# Altium schematic sheet JacdacRp2040BrainEc30 124 snapshot with PADAUK.SchDoc: complete design (part 1 of 2)
size A3; DocumentNumber: 1; SheetNumber: 1; SheetTotal: 1; VersionControl_RevNumber: 1
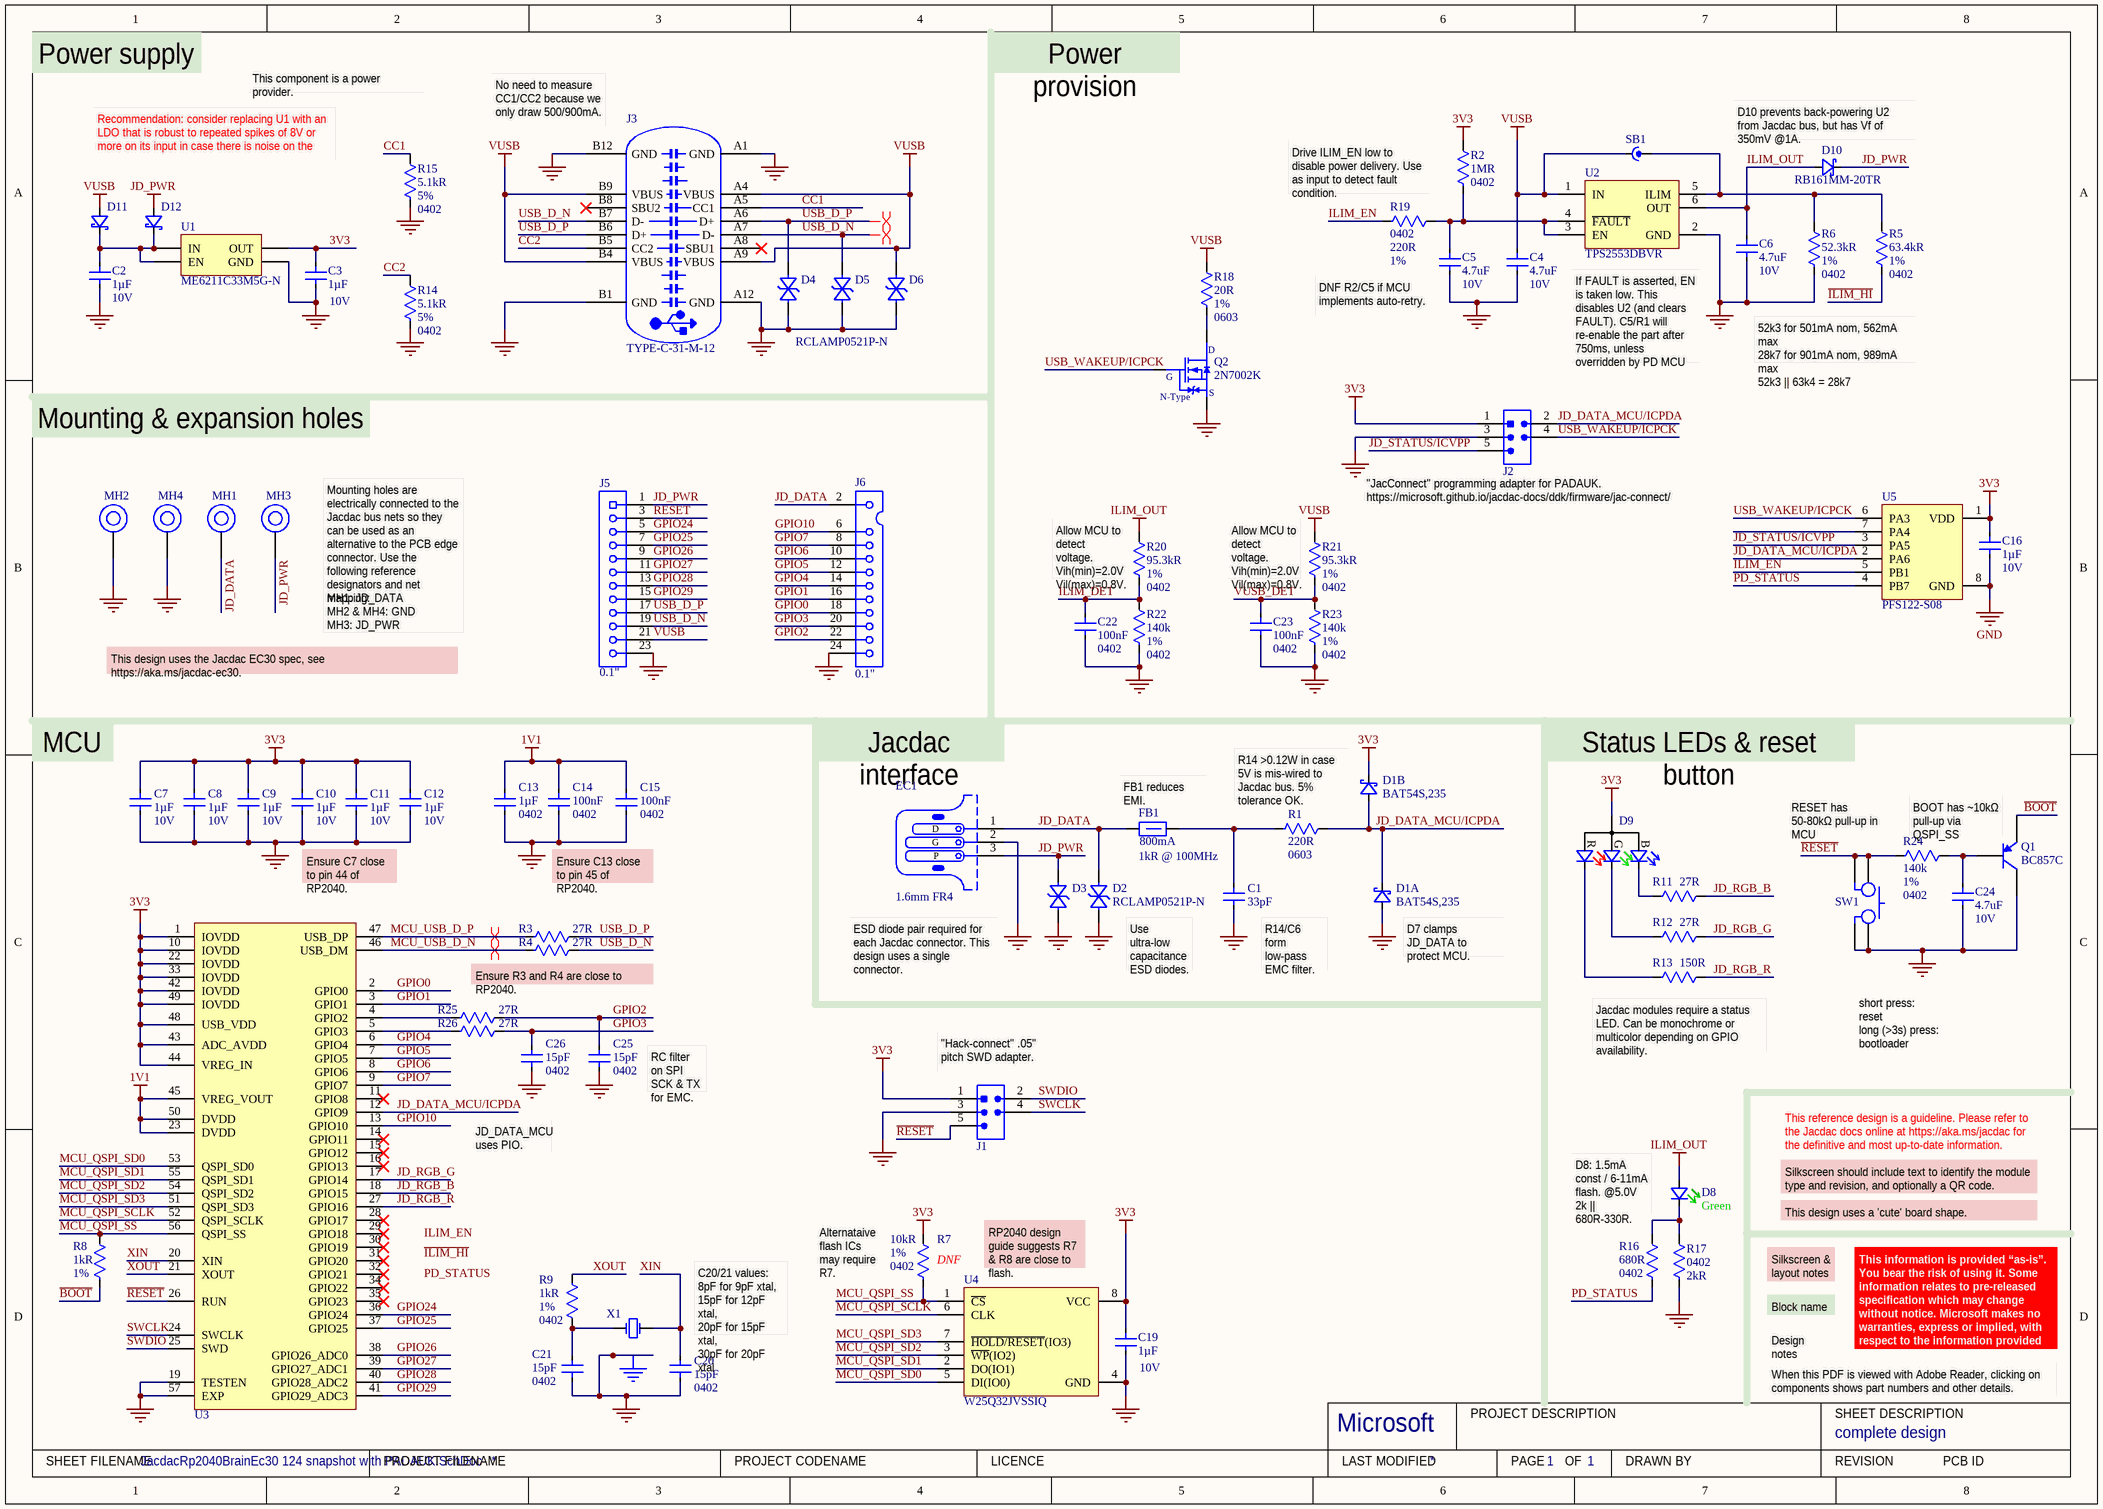
[diagram p0: JacdacRp2040BrainEc30 124 snapshot with PADAUK.SchDoc]

## Parts
C1  Capacitance: 33pF  [C0402_0.55MM - without outline]  (hidden comment: CL05C330JB51PNC)
C2  Capacitance: 1µF  Voltage Rating: 10V  [C0402_0.55MM - without outline]  (hidden comment: CL05A105KP5NNNC)
C3  Capacitance: 1µF  Voltage Rating: 10V  [C0402_0.55MM - without outline]  (hidden comment: CL05A105KP5NNNC)
C4  Capacitance: 4.7uF  Voltage Rating: 10V  [C0402_0.55mm - without outline]  (hidden comment: CL05A475MP5NRNC)
C5  Capacitance: 4.7uF  Voltage Rating: 10V  [C0402_0.55mm - without outline]  (hidden comment: CL05A475MP5NRNC)
C6  Capacitance: 4.7uF  Voltage Rating: 10V  [C0402_0.55mm - without outline]  (hidden comment: CL05A475MP5NRNC)
C7  Capacitance: 1µF  Voltage Rating: 10V  [C0402_0.55MM - without outline]  (hidden comment: CL05A105KP5NNNC)
C8  Capacitance: 1µF  Voltage Rating: 10V  [C0402_0.55MM - without outline]  (hidden comment: CL05A105KP5NNNC)
C9  Capacitance: 1µF  Voltage Rating: 10V  [C0402_0.55MM - without outline]  (hidden comment: CL05A105KP5NNNC)
C10  Capacitance: 1µF  Voltage Rating: 10V  [C0402_0.55MM - without outline]  (hidden comment: CL05A105KP5NNNC)
C11  Capacitance: 1µF  Voltage Rating: 10V  [C0402_0.55MM - without outline]  (hidden comment: CL05A105KP5NNNC)
C12  Capacitance: 1µF  Voltage Rating: 10V  [C0402_0.55MM - without outline]  (hidden comment: CL05A105KP5NNNC)
C13  Case/Package: 0402  Capacitance: 1µF  [C0402_0.55MM - without outline]  (hidden comment: CL05A105KP5NNNC)
C14  Capacitance: 100nF  Case Code (Imperial): 0402  [C0402_0.55MM - without outline]  (hidden comment: CL05B104KP5NNNC)
C15  Capacitance: 100nF  Case Code (Imperial): 0402  [C0402_0.55MM - without outline]  (hidden comment: CL05B104KP5NNNC)
C16  Capacitance: 1µF  Voltage Rating: 10V  [C0402_0.55MM - without outline]  (hidden comment: CL05A105KP5NNNC)
C19  Capacitance: 1µF  Voltage Rating: 10V  [C0402_0.55MM - without outline]  (hidden comment: CL05A105KP5NNNC)
C20  Capacitance: 15pF  Case/Package: 0402  [C0402_0.55MM - without outline]  (hidden comment: CL05C150JB5NNNC)
C21  Capacitance: 15pF  Case/Package: 0402  [C0402_0.55MM - without outline]  (hidden comment: CL05C150JB5NNNC)
C22  Capacitance: 100nF  Case Code (Imperial): 0402  [C0402_0.55MM - without outline]  (hidden comment: CL05B104KP5NNNC)
C23  Capacitance: 100nF  Case Code (Imperial): 0402  [C0402_0.55MM - without outline]  (hidden comment: CL05B104KP5NNNC)
C24  Capacitance: 4.7uF  Voltage Rating: 10V  [C0402_0.55mm - without outline]  (hidden comment: CL05A475MP5NRNC)
C25  Capacitance: 15pF  Case/Package: 0402  [C0402_0.55MM - without outline]  (hidden comment: CL05C150JB5NNNC)
C26  Capacitance: 15pF  Case/Package: 0402  [C0402_0.55MM - without outline]  (hidden comment: CL05C150JB5NNNC)
D1  Manufacturer Part Number: BAT54S,235  [NXP-BAT54S-TO-236AB - without outline]  (hidden comment: BAT54S)  (parts A,B of 2)
D2  RCLAMP0521P-N  [TVS 0402 - L]
D3  RCLAMP0521P-N  [TVS 0402 - L]  (value not drawn)
D4  RCLAMP0521P-N  [TVS 0402 - L]  (value not drawn)
D5  RCLAMP0521P-N  [TVS 0402 - L]  (value not drawn)
D6  RCLAMP0521P-N  [TVS 0402 - L]
D8  Colour: Green  [0603 Green]  (hidden comment: 19-217/GHC-YR1S2/3T)
D9  TZ-P4-1615RGBTCA1-0.55T  [TZ-P4-1615RGBTCA1-0.55T]  (value not drawn)
D10  RB161MM-20TR  [SOD-123F - without outline]
D11  RB161MM-20TR  [SOD-123F - without outline]  (value not drawn)
D12  RB161MM-20TR  [SOD-123F - without outline]  (value not drawn)
EC1  PCB Type: 1.6mm FR4  [JACDAC_EDGE_CONNECTOR_NO_TRACES]  (hidden comment: 3 pin JACDAC edge connector)  (no BOM)
FB1  Current Rating: 800mA  Impedance: 1kR @ 100MHz  [TDK MPZ1608 0.8mm - without outline]  (hidden comment: TDK MPZ1608S102ATA00)
J1  Hack Connect Mini 1.27 mm pitch 2-row  [HACK_CONNECT_MINI_5_X_1_27]  (value not drawn)  (no BOM)
J2  Hack Connect Mini 1.27 mm pitch 2-row  [HACK_CONNECT_MINI_5_X_1_27_0.559mm_TH]  (value not drawn)  (no BOM)
J3  TYPE-C-31-M-12  [TYPE-C-31-M-12]
J5  0.1"  [Jacdac EC30 stamp holes 30mm bottom]
J6  0.1"  [Jacdac EC30 stamp holes 30mm top]
MH1  MH_7.0MMK_4.4MMC_3.1MMD_PTH  [MH_7.0MMK_4.4MMC_3.1MMD_PTH]  (value not drawn)  (no BOM)
MH2  MH_7.0MMK_4.4MMC_3.1MMD_PTH  [MH_7.0MMK_4.4MMC_3.1MMD_PTH]  (value not drawn)  (no BOM)
MH3  MH_7.0MMK_4.4MMC_3.1MMD_PTH  [MH_7.0MMK_4.4MMC_3.1MMD_PTH]  (value not drawn)  (no BOM)
MH4  MH_7.0MMK_4.4MMC_3.1MMD_PTH  [MH_7.0MMK_4.4MMC_3.1MMD_PTH]  (value not drawn)  (no BOM)
Q1  BC857C  [NXP-SOT23 - without outline]
Q2  2N7002K  [SOT23-ONS]
R1  Case/Package: 0603  [RC0603]  (hidden comment: 220R)
R2  Resistance: 1MR  Case Code (Imperial): 0402  [R0402 - Without outline]
R3  Resistance: 27R  [R0402 - Without outline]  (hidden comment: RC0402FR-0727RL)
R4  Resistance: 27R  [R0402 - Without outline]  (hidden comment: RC0402FR-0727RL)
R5  Resistance: 63.4kR  Tolerance: 1%  Case Code (Imperial): 0402  [R0402 - Without outline]  (hidden comment: RC0402FR-0763K4L)
R6  Resistance: 52.3kR  Tolerance: 1%  Case Code (Imperial): 0402  [R0402 - Without outline]  (hidden comment: RC0402FR-0752K3L)
R7  Resistance: 10kR  Tolerance: 1%  Case Code (Imperial): 0402  [R0402 - Without outline]  (hidden comment: 10k)
R8  Resistance: 1kR  Tolerance: 1%  [R0402 - Without outline]  (hidden comment: RC0402FR-071KL)
R9  Resistance: 1kR  Tolerance: 1%  Case Code (Imperial): 0402  [R0402 - Without outline]  (hidden comment: RC0402FR-071KL)
R11  Resistance: 27R  [R0402 - Without outline]  (hidden comment: RC0402FR-0727RL)
R12  Resistance: 27R  [R0402 - Without outline]  (hidden comment: RC0402FR-0727RL)
R13  Resistance: 150R  [R0402 - Without outline]  (hidden comment: RC0402FR-07150RL)
R14  Resistance: 5.1kR  Tolerance: 5%  Case Code (Imperial): 0402  [R0402 - Without outline]  (hidden comment: RC0402JR-075K1L)
R15  Resistance: 5.1kR  Tolerance: 5%  Case Code (Imperial): 0402  [R0402 - Without outline]  (hidden comment: RC0402JR-075K1L)
R16  Resistance: 680R  Case Code (Imperial): 0402  [R0402 - Without outline]  (hidden comment: RC0402FR-07680RL)
R17  Case/Package: 0402  Resistance: 2kR  [R0402 - Without outline]  (hidden comment: RC0402FR-072KL)
R18  Resistance: 20R  Tolerance: 1%  Case Code (Imperial): 0603  [RC0603]  (hidden comment: RC0603FR-0720RL)
R19  Case Code (Imperial): 0402  Resistance: 220R  Tolerance: 1%  [R0402 - without outline]  (hidden comment: RC0402FR-07220RL)
R20  Resistance: 95.3kR  Tolerance: 1%  Case Code (Imperial): 0402  [R0402 - Without outline]  (hidden comment: RC0402FR-0795K3L)
R21  Resistance: 95.3kR  Tolerance: 1%  Case Code (Imperial): 0402  [R0402 - Without outline]  (hidden comment: RC0402FR-0795K3L)
R22  Resistance: 140k  Tolerance: 1%  Case/Package: 0402  [R0402 - Without outline]  (hidden comment: RC0402FR-07100KL)
R23  Resistance: 140k  Tolerance: 1%  Case/Package: 0402  [R0402 - Without outline]  (hidden comment: RC0402FR-07100KL)
R24  Resistance: 140k  Tolerance: 1%  Case/Package: 0402  [R0402 - Without outline]  (hidden comment: RC0402FR-07100KL)
R25  Resistance: 27R  [R0402 - Without outline]  (hidden comment: RC0402FR-0727RL)
R26  Resistance: 27R  [R0402 - Without outline]  (hidden comment: RC0402FR-0727RL)
SB1  OpenSolderBlob  [SolderBlobB]  (value not drawn)  (no BOM)
SW1  UK-B0267-SP25Y  [USAKRO-UK-B0267-SP25Y]  (value not drawn)
U1  ME6211C33M5G-N  [MICRONE-SOT23-5]
U2  TPS2553DBVR  [TI-TPS2553 - without_outline]
U3  RP2040  [RP2040-SAFER-VIAS]  (value not drawn)
U4  (no value)  [8-SOIC]
U5  PFS122-S08  [SOP-8]
X1  generic SMD xtal 3.2x2.5mm  [generic xtal 3.2x2.5]  (value not drawn)

## Nets
1V1: C13.2 C14.2 C15.2 U3.23(DVDD) U3.45(VREG_VOUT) U3.50(DVDD)
3V3: C3.2 C7.2 C8.2 C9.2 C10.2 C11.2 C12.2 C16.2 C19.2 D1.2(K) D9.1(A) J1.1(VCC) J2.1(VCC) R2.1 R7.1 U1.5(OUT) U3.1(IOVDD) U3.10(IOVDD) U3.22(IOVDD) U3.33(IOVDD) U3.42(IOVDD) U3.43(ADC_AVDD) U3.44(VREG_IN) U3.48(USB_VDD) U3.49(IOVDD) U4.8(VCC) U5.1(VDD)
GND: C1.1 C2.1 C3.1 C4.1 C5.1 C6.1 C7.1 C8.1 C9.1 C10.1 C11.1 C12.1 C13.1 C14.1 C15.1 C16.1 C19.1 C20.2 C21.2 C22.1 C23.1 C24.1 C25.2 C26.2 D1.1(A) D2.2(A) D3.2(A) D4.2(A) D5.2(A) D6.2(A) EC1.2(G) J1.3(GND) J2.3(GND) J3.A1(GND) J3.A12(GND) J3.B1(GND) J3.B12(GND) J5.23 J6.24 MH2.1 MH4.1 Q1.3(C) Q2.2(S) R6.1 R14.2 R15.2 R17.2 R22.1 R23.1 SW1.3 SW1.4 U1.2(GND) U2.2(GND) U3.19(TESTEN) U3.57(EXP) U4.4(GND) U5.8(GND) X1.2 X1.4
ILIM_OUT: C6.2 D8.2(A) D10.2(A) R20.2 U2.6(OUT)
JD_PWR: D3.1(K) D10.1(K) D12.2(A) EC1.3(P) J5.1 MH3.1
VUSB: C4.2 D6.1(K) D11.2(A) J3.A4(VBUS) J3.A9(VBUS) J3.B4(VBUS) J3.B9(VBUS) J5.21 R18.2 R21.2 SB1.2 U2.1(IN)
~{BOOT}: Q1.2(E) R8.2
CC1: J3.A5(CC1) R15.1
CC2: J3.B5(CC2) R14.1
GPIO0: J6.18 U3.2(GPIO0)
GPIO1: J6.16 U3.3(GPIO1)
GPIO2: C25.1 J6.22 R25.2
GPIO3: C26.1 J6.20 R26.2
GPIO4: J6.14 U3.6(GPIO4)
GPIO5: J6.12 U3.7(GPIO5)
GPIO6: J6.10 U3.8(GPIO6)
GPIO7: J6.8 U3.9(GPIO7)
GPIO10: J6.6 U3.13(GPIO10)
GPIO24: J5.5 U3.36(GPIO24)
GPIO25: J5.7 U3.37(GPIO25)
GPIO26: J5.9 U3.38(GPIO26_ADC0)
GPIO27: J5.11 U3.39(GPIO27_ADC1)
GPIO28: J5.13 U3.40(GPIO28_ADC2)
GPIO29: J5.15 U3.41(GPIO29_ADC3)
~{ILIM_HI}: R5.1
ILIM_DET: C22.2 R20.1 R22.2
ILIM_EN: R19.2 U5.5(PB1)
JD_DATA: D2.1(K) EC1.1(D) FB1.1 J6.2 MH1.1
JD_DATA_MCU/ICPDA: D1.3(K) J2.2(SWDIO) R1.2 U3.12(GPIO9) U5.2(PA6)
JD_RGB_B: R11.2 U3.18(GPIO15)
JD_RGB_G: R12.2 U3.17(GPIO14)
JD_RGB_R: R13.2 U3.27(GPIO16)
JD_STATUS/ICVPP: J2.5(RESET) U5.3(PA5)
MCU_QSPI_SCLK: U3.52(QSPI_SCLK) U4.6(CLK)
MCU_QSPI_SD0: U3.53(QSPI_SD0) U4.5(DI(IO0))
MCU_QSPI_SD1: U3.55(QSPI_SD1) U4.2(DO(IO1))
MCU_QSPI_SD2: U3.54(QSPI_SD2) U4.3(~{WP}(IO2))
MCU_QSPI_SD3: U3.51(QSPI_SD3) U4.7(~{HOLD/RESET}(IO3))
MCU_QSPI_SS: R7.2 R8.1 U3.56(QSPI_SS) U4.1(~{CS})
MCU_USB_D_N: R4.1 U3.46(USB_DM)
MCU_USB_D_P: R3.1 U3.47(USB_DP)
PD_STATUS: R16.1 U5.4(PB7)
~{RESET}: J1.5(RESET) J5.3 R24.1 SW1.1 SW1.2 U3.26(RUN)
SWCLK: J1.4(SWCLK) U3.24(SWCLK)
SWDIO: J1.2(SWDIO) U3.25(SWD)
USB_D_N: D5.1(K) J3.A7(D-) J3.B7(D-) J5.19 R4.2
USB_D_P: D4.1(K) J3.A6(D+) J3.B6(D+) J5.17 R3.2
USB_WAKEUP/ICPCK: J2.4(SWCLK) Q2.1(G) U5.6(PA3)
VUSB_DET: C23.2 R21.1 R23.2
XIN: C20.1 U3.20(XIN) X1.3
XOUT: R9.2 U3.21(XOUT)
NetC1_2: C1.2 FB1.2 R1.1
NetC2_2: C2.2 D11.1(K) D12.1(K) U1.1(IN) U1.3(EN)
NetC5_2: C5.2 R2.2 R19.1 U2.3(EN) U2.4(~{FAULT})
NetC21_1: C21.1 R9.1 X1.1
NetC24_2: C24.2 Q1.1(B) R24.2
NetD8_1: D8.1(K) R16.2 R17.1
NetD9_2: D9.2(R) R13.1
NetD9_3: D9.3(G) R12.1
NetD9_4: D9.4(B) R11.1
NetQ2_3: Q2.3(D) R18.1
NetR5_2: R5.2 R6.2 SB1.1 U2.5(ILIM)
NetR25_1: R25.1 U3.4(GPIO2)
NetR26_1: R26.1 U3.5(GPIO3)

Not connected (* = marked no-connect by the designer): J3 A8(SBU1)* B8(SBU2)*; U3 11(GPIO8)* 14(GPIO11)* 15(GPIO12)* 16(GPIO13)* 28(GPIO17)* 29(GPIO18)* 30(GPIO19)* 31(GPIO20)* 32(GPIO21)* 34(GPIO22)* 35(GPIO23)*; U5 7(PA4)

## Layout directives
differential pair: MCU_USB_D_N, MCU_USB_D_P, USB_D_N, USB_D_P

## Notes on the sheet
- Power supply
- This component is a power provider.
- Power provision
- Recommendation: consider replacing U1 with an LDO that is robust to repeated spikes of 8V or more on its input in case there is noise on the Jacdac bus.
- (near J3) No need to measure CC1/CC2 because we only draw 500/900mA.
- (near D10) D10 prevents back-powering U2 from Jacdac bus, but has Vf of 350mV @1A.
- Drive ILIM_EN low to disable power delivery. Use as input to detect fault condition.
- (near C5) DNF R2/C5 if MCU implements auto-retry.
- If FAULT is asserted, EN is taken low. This disables U2 (and clears FAULT). C5/R1 will re-enable the part after 750ms, unless overridden by PD MCU
- 52k3 for 501mA nom, 562mA max
  28k7 for 901mA nom, 989mA max
  52k3 || 63k4 = 28k7
- Mounting & expansion holes
- (near J2) "JacConnect" programming adapter for PADAUK.
  https://microsoft.github.io/jacdac-docs/ddk/firmware/jac-connect/
- (near MH3) Mounting holes are electrically connected to the Jacdac bus nets so they can be used as an alternative to the PCB edge connector. Use the following reference designators and net mapping:
- (near R20) Allow MCU to detect voltage. Vih(min)=2.0V
  Vil(max)=0.8V.
- (near R21) Allow MCU to detect voltage. Vih(min)=2.0V
  Vil(max)=0.8V.
- MH1: JD_DATA
  MH2 & MH4: GND
  MH3: JD_PWR
- This design uses the Jacdac EC30 spec, see https://aka.ms/jacdac-ec30.
- (near C7) MCU
- Jacdac interface
- Status LEDs & reset button
- (near FB1) FB1 reduces EMI.
- R14 >0.12W in case 5V is mis-wired to Jacdac bus. 5% tolerance OK.
- RESET has 50-80kΩ pull-up in MCU
- (near Q1) BOOT has ~10kΩ pull-up via QSPI_SS
- Ensure C7 close to pin 44 of RP2040.
- Ensure C13 close to pin 45 of RP2040.
- (near R4) Ensure R3 and R4 are close to RP2040.
- ESD diode pair required for each Jacdac connector. This design uses a single connector.
- Use ultra-low capacitance ESD diodes.
- (near C1) R14/C6 form low-pass EMC filter.
- (near D1) D7 clamps JD_DATA to protect MCU.
- (near R13) Jacdac modules require a status LED. Can be monochrome or multicolor depending on GPIO availability.
- short press:
  reset
  long (>3s) press:
  bootloader
- (near C25) RC filter on SPI SCK & TX for EMC.
- (near J1) "Hack-connect" .05" pitch SWD adapter.
- JD_DATA_MCU uses PIO.
- Silkscreen should include text to identify the module type and revision, and optionally a QR code.
- This reference design is a guideline. Please refer to the Jacdac docs online at https://aka.ms/jacdac for the definitive and most up-to-date information.
- (near R7) Alternataive flash ICs may require R7.
- (near R7) DNF
- (near U4) RP2040 design guide suggests R7 & R8 are close to flash.
- D8: 1.5mA const / 6-11mA flash. @5.0V 2k || 680R-330R.
- This design uses a 'cute' board shape.
- Block name
- Silkscreen & layout notes
- (near C20) C20/21 values:
  8pF for 9pF xtal,
  15pF for 12pF xtal,
  20pF for 15pF xtal,
  30pF for 20pF xtal
- Design notes
- When this PDF is viewed with Adobe Reader, clicking on components shows part numbers and other details.
- This information is provided “as-is”. You bear the risk of using it. Some information relates to pre-released specification which may change without notice. Microsoft makes no warranties, express or implied, with respect to the information provided here.
- Labels drawn without touching a wire or pin: ILIM_EN, PD_STATUS, ~{ILIM_HI}
- Microsoft
- PROJECT DESCRIPTION
- SHEET DESCRIPTION
- SHEET FILENAME
- PROJECT FILENAME
- PROJECT CODENAME
- LICENCE
- LAST MODIFIED
- PAGE
- OF
- DRAWN BY
- REVISION
- PCB ID
- (in symbol 2N7002K) N-Type